# Altium project OZ440-SE100-CAR003.PrjPcb (part 3 of 3)

## Sheet OZ440-SE100-CAR003_sheet13.SchDoc
size A3
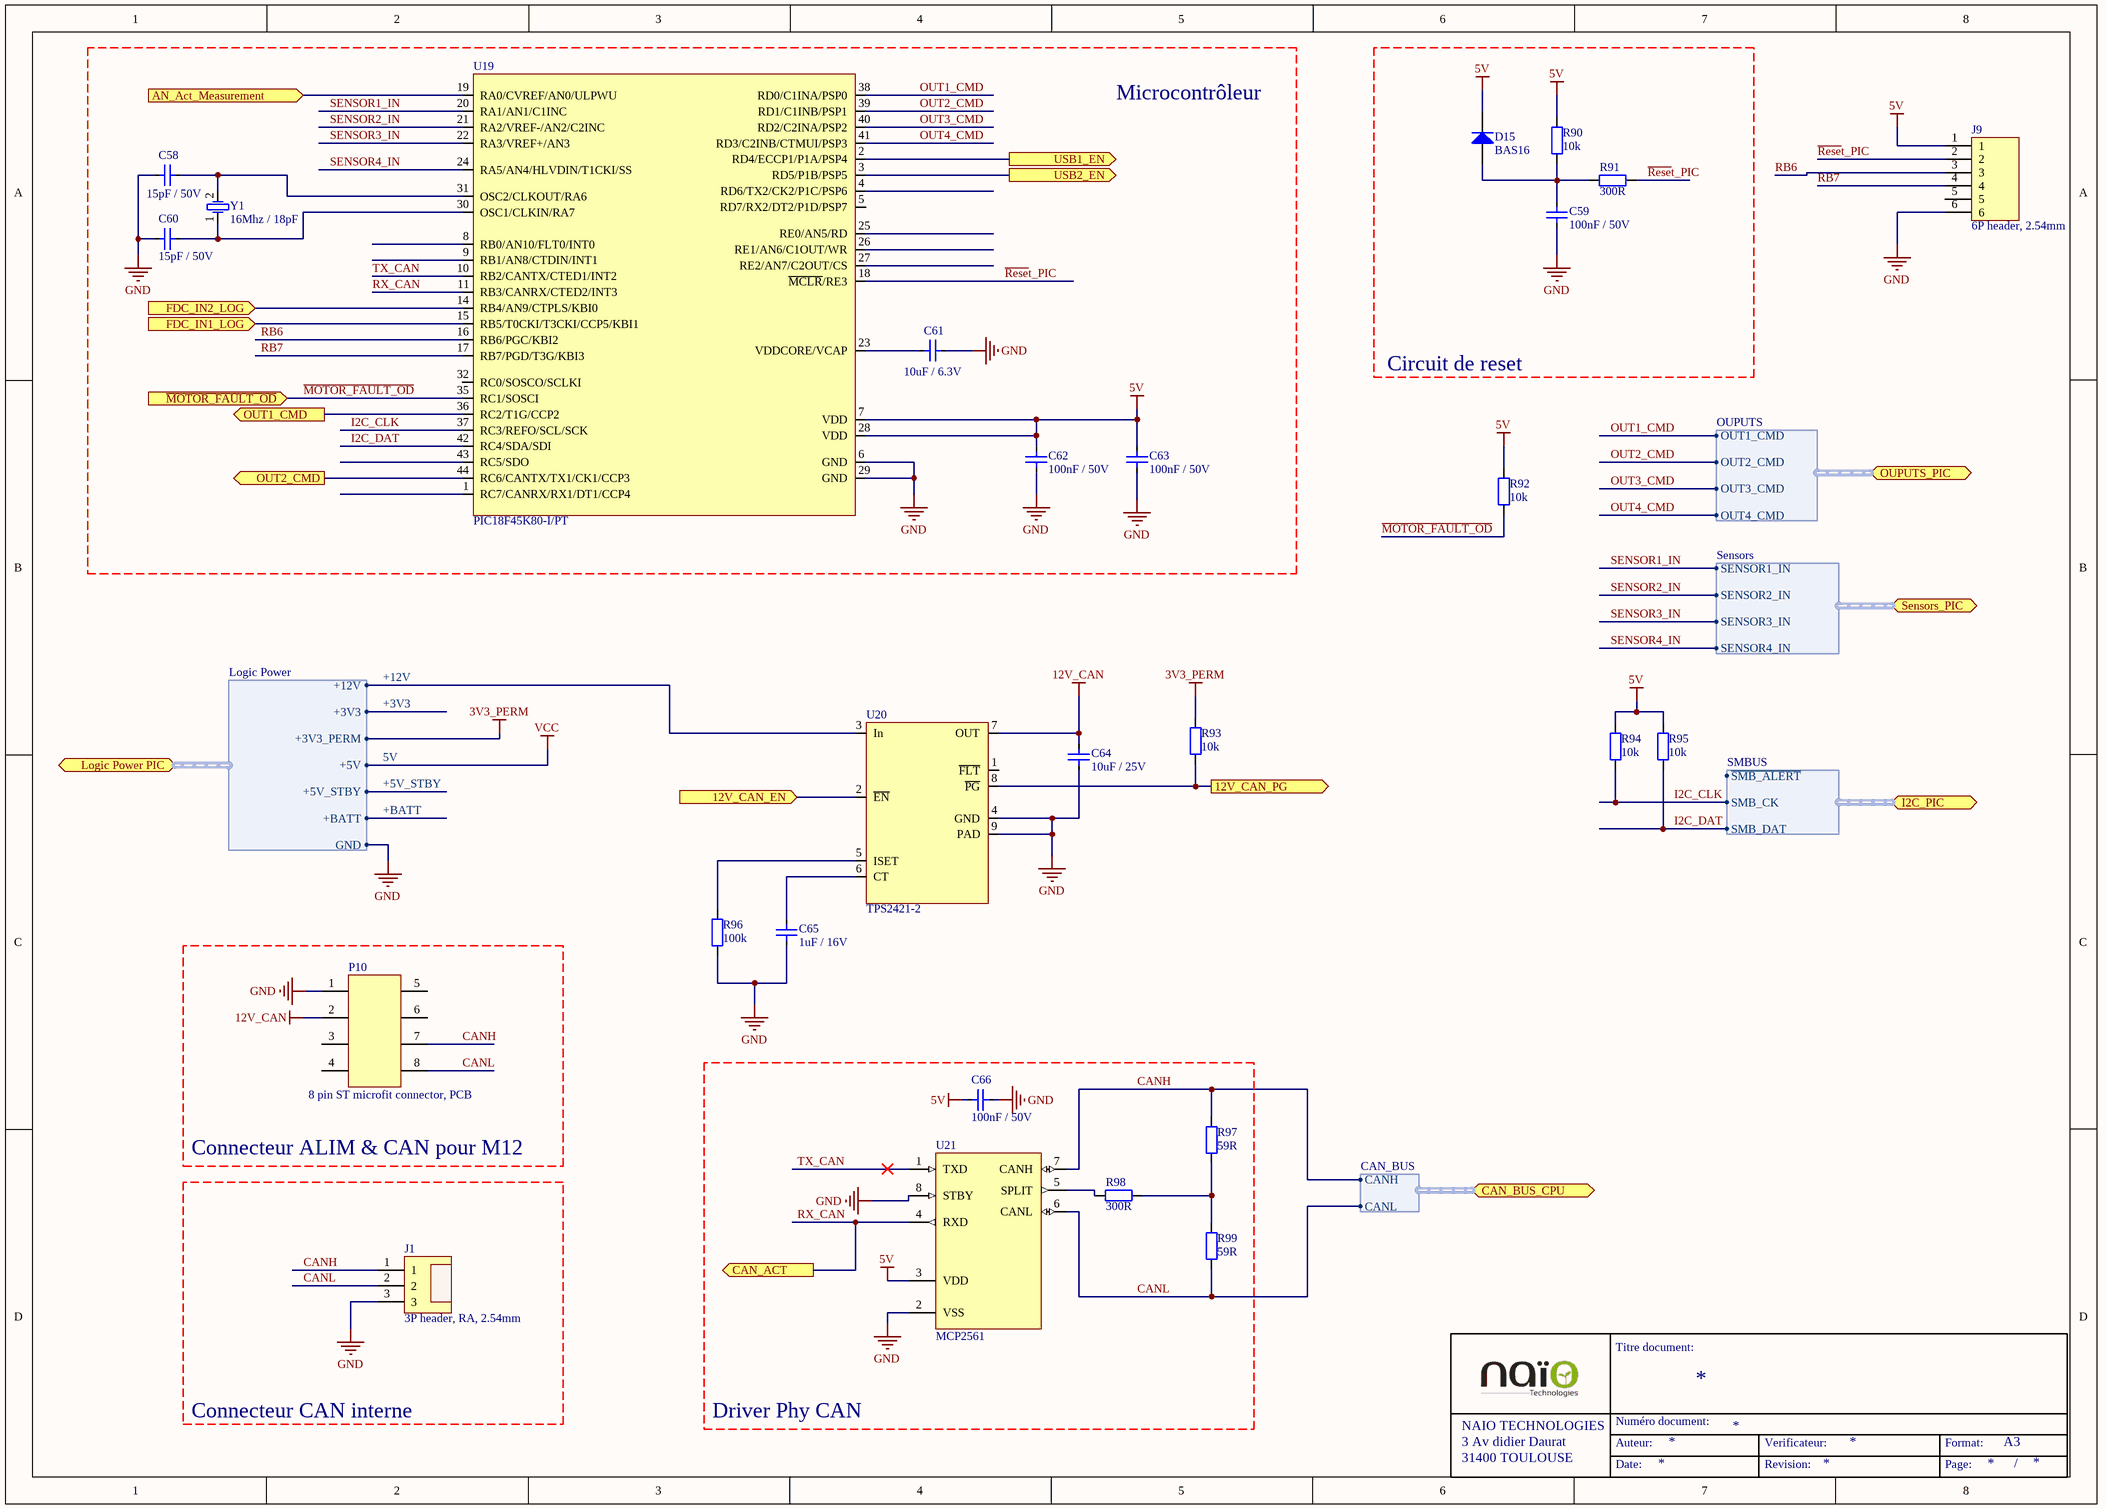
[diagram p12: OZ440-SE100-CAR003_sheet13.SchDoc]

### Parts
C58  Displayed reference: 15pF / 50V  [C0805-STD]  (hidden comment: CAP-SMD)
C59  Displayed reference: 100nF / 50V  [C0805-STD]  (hidden comment: CAP-SMD)
C60  Displayed reference: 15pF / 50V  [C0805-STD]  (hidden comment: CAP-SMD)
C61  Displayed reference: 10uF / 6.3V  [C0805-STD]  (hidden comment: CAP-SMD)
C62  Displayed reference: 100nF / 50V  [C0805-STD]  (hidden comment: CAP-SMD)
C63  Displayed reference: 100nF / 50V  [C0805-STD]  (hidden comment: CAP-SMD)
C64  Displayed reference: 10uF / 25V  [C1206-STD]  (hidden comment: CAP-SMD)
C65  Displayed reference: 1uF / 16V  [C0805-STD]  (hidden comment: CAP-SMD)
C66  Displayed reference: 100nF / 50V  [C0805-STD]  (hidden comment: CAP-SMD)
D15  Displayed reference: BAS16  [SOT23-STD]  (hidden comment: BAS16-SOT23)
J1  Displayed reference: 3P header, RA, 2.54mm  [CONN-SPE_MOLEX_0015913033]  (hidden comment: CONN-STD-3P_1ROW)
J9  Displayed reference: 6P header, 2.54mm  [6P_HEADER-STD_TH_1ROW]  (hidden comment: CONN-STD-6P_1ROW)
P10  Displayed reference: 8 pin ST microfit connector, PCB  [CONN-SPE_MOLEX_43045-0812]  (hidden comment: CONN-SPE-8P_MOLEX_43045-0801)
R90  Displayed reference: 10k  [R0805-STD]  (hidden comment: RES-SMD)
R91  Displayed reference: 300R  [R0805-STD]  (hidden comment: RES-SMD)
R92  Displayed reference: 10k  [R0805-STD]  (hidden comment: RES-SMD)
R93  Displayed reference: 10k  [R0805-STD]  (hidden comment: RES-SMD)
R94  Displayed reference: 10k  [R0805-STD]  (hidden comment: RES-SMD)
R95  Displayed reference: 10k  [R0805-STD]  (hidden comment: RES-SMD)
R96  Displayed reference: 100k  [R0805-STD]  (hidden comment: RES-SMD)
R97  Displayed reference: 59R  [R0805-STD]  (hidden comment: RES-SMD)
R98  Displayed reference: 300R  [R0805-STD]  (hidden comment: RES-SMD)
R99  Displayed reference: 59R  [R0805-STD]  (hidden comment: RES-SMD)
U19  Displayed reference: PIC18F45K80-I/PT  [TQFP44-SPE-PIC18F45k80]  (hidden comment: P18F45K80-TQFP44)
U20  Displayed reference: TPS2421-2  [SO8_THERMAL-STD]  (hidden comment: TPS2421-SO8)
U21  Displayed reference: MCP2561  [SO8-SPE-MCP2561]  (hidden comment: MCP2561-SOIC08)
Y1  Displayed reference: 16Mhz / 18pF  [XTAL-SPE-HC49_SMD]  (hidden comment: XTAL-SMD)

### Ports
12V_CAN_EN (in), 12V_CAN_PG (out), AN_Act_Measurement (in), CAN_ACT (out), CAN_BUS_CPU (harness CAN_BUS), FDC_IN1_LOG (in), FDC_IN2_LOG (in), I2C_PIC (harness SMBUS), Logic Power PIC (harness Logic Power), OUPUTS_PIC (harness OUPUTS), OUT1_CMD (out), OUT2_CMD (out), Sensors_PIC (harness Sensors), USB1_EN (out), USB2_EN (out), ~{MOTOR_FAULT_OD} (in)

### Harnesses
CAN_BUS: CANH, CANL
Logic Power: +12V, +3V3, +3V3_PERM, +5V, +5V_STBY, +BATT, GND
OUPUTS: OUT1_CMD, OUT2_CMD, OUT3_CMD, OUT4_CMD
Sensors: SENSOR1_IN, SENSOR2_IN, SENSOR3_IN, SENSOR4_IN
SMBUS: ~{SMB_ALERT}, SMB_CK, SMB_DAT

### Nets
3V3_PERM: R93.1 ; port Logic Power PIC.+3V3_PERM  [project net +3V3_PERM]
12V_CAN: C64.2 P10.2 U20.7(OUT)
+5V_STBY: C62.2 C63.2 C66.2 D15.3(K) J9.1 R90.2 R92.2 R94.2 R95.2 U19.7(VDD) U19.28(VDD) U21.3(VDD) ; port Logic Power PIC.+5V, port Logic Power PIC.+5V_STBY  [also labelled 5V, VCC]  [project net +5V]
GND: C58.1 C59.1 C60.1 C61.2 C62.1 C63.1 C64.1 C65.1 C66.1 J1.3 J9.6 P10.1 R96.1 U19.6(GND) U19.29(GND) U20.4(GND) U20.9(PAD) U21.2(VSS) U21.8(STBY) ; port Logic Power PIC.GND  [project net Logic_Power.GND]
12V_CAN_EN: U20.2(~{EN}) ; port 12V_CAN_EN
12V_CAN_PG: R93.2 U20.8(~{PG}) ; port 12V_CAN_PG
+12V: U20.3(In) ; port Logic Power PIC.+12V
~{MOTOR_FAULT_OD}: R92.1 U19.35(RC1/SOSCI) ; port ~{MOTOR_FAULT_OD}
~{Rese}t_PIC: J9.2 R91.2 U19.18(~{MCLR}/RE3)
CANH: J1.1 P10.7 R97.2 U21.7(CANH) ; port CAN_BUS_CPU.CANH  [project net CAN_bus.CANH]
CANL: J1.2 P10.8 R99.1 U21.6(CANL) ; port CAN_BUS_CPU.CANL  [project net CAN_bus.CANL]
I2C_CLK: R94.1 U19.37(RC3/REFO/SCL/SCK) ; port I2C_PIC.SMB_CK
I2C_DAT: R95.1 U19.42(RC4/SDA/SDI) ; port I2C_PIC.SMB_DAT
OUT1_CMD: U19.38(RD0/C1INA/PSP0) ; port OUPUTS_PIC.OUT1_CMD
OUT2_CMD: U19.39(RD1/C1INB/PSP1) ; port OUPUTS_PIC.OUT2_CMD
OUT3_CMD: U19.40(RD2/C2INA/PSP2) ; port OUPUTS_PIC.OUT3_CMD
OUT4_CMD: U19.41(RD3/C2INB/CTMUI/PSP3) ; port OUPUTS_PIC.OUT4_CMD
RB6: J9.3 U19.16(RB6/PGC/KBI2)
RB7: J9.4 U19.17(RB7/PGD/T3G/KBI3)
RX_CAN: U19.11(RB3/CANRX/CTED2/INT3) U21.4(RXD) ; port CAN_ACT  [project net CAN_ACT]
SENSOR1_IN: U19.20(RA1/AN1/C1INC) ; port Sensors_PIC.SENSOR1_IN
SENSOR2_IN: U19.21(RA2/VREF-/AN2/C2INC) ; port Sensors_PIC.SENSOR2_IN
SENSOR3_IN: U19.22(RA3/VREF+/AN3) ; port Sensors_PIC.SENSOR3_IN
SENSOR4_IN: U19.24(RA5/AN4/HLVDIN/T1CKI/SS) ; port Sensors_PIC.SENSOR4_IN
TX_CAN: U19.10(RB2/CANTX/CTED1/INT2) U21.1(TXD)
NetC51_2: U19.19(RA0/CVREF/AN0/ULPWU) ; port AN_Act_Measurement
NetC52_2: U19.15(RB5/T0CKI/T3CKI/CCP5/KBI1) ; port FDC_IN1_LOG
NetC53_2: U19.14(RB4/AN9/CTPLS/KBI0) ; port FDC_IN2_LOG
NetC58_2: C58.2 U19.31(OSC2/CLKOUT/RA6) Y1.2(OSC2)
NetC59_2: C59.2 D15.1(A) R90.1 R91.1
NetC60_2: C60.2 U19.30(OSC1/CLKIN/RA7) Y1.1(OSC1)
NetC61_1: C61.1 U19.23(VDDCORE/VCAP)
NetC65_2: C65.2 U20.6(CT)
NetQ28_1: U19.2(RD4/ECCP1/P1A/PSP4) ; port USB1_EN
NetQ29_1: U19.3(RD5/P1B/PSP5) ; port USB2_EN
NetR83_1: U19.36(RC2/T1G/CCP2) ; port OUT1_CMD
NetR84_1: U19.44(RC6/CANTX/TX1/CK1/CCP3) ; port OUT2_CMD
NetR96_2: R96.2 U20.5(ISET)
NetR97_1: R97.1 R98.2 R99.2
NetR98_1: R98.1 U21.5(SPLIT)

Not connected (* = marked no-connect by the designer): J9 5; P10 3 4(7) 5(9) 6; U19 1(RC7/CANRX/RX1/DT1/CCP4) 4(RD6/TX2/CK2/P1C/PSP6) 5(RD7/RX2/DT2/P1D/PSP7) 8(RB0/AN10/FLT0/INT0) 9(RB1/AN8/CTDIN/INT1) 25(RE0/AN5/RD) 26(RE1/AN6/C1OUT/WR) 27(RE2/AN7/C2OUT/CS) 32(RC0/SOSCO/SCLKI) 43(RC5/SDO); U20 1(~{FLT})

### Notes on the sheet
- Microcontrôleur
- Circuit de reset
- Connecteur ALIM & CAN pour M12
- Connecteur CAN interne
- Driver Phy CAN
- Titre document:
- NAIO TECHNOLOGIES
- 3 Av didier Daurat
- 31400 TOULOUSE
- Auteur:
- Numéro document:
- Verificateur:
- Format:
- A3
- Date:
- Revision:
- Page:
- /

### Library data of the parts
C58 C60 = C0805C150J5GACxx: 0805 15pF / 50V COG ceramic capacitor; Manufacturer: Kemet; Max Voltage: 50; Tolerance: +/- 5%; Validated: N; Reference: C0805C150J5GACxx; Value: 15pF; Material: COG; Footprint description: standard Capacitor 0805; Pin Count: 2; helpURL: http://www.farnell.com/datasheets/40863.pdf; Supplier 1: Farnell; Supplier Part Number 1: 1650868; Supplier 2: Digi-Key; Supplier Part Number 2: 399-1111-1-ND
C59 C62 C63 C66 = VJ0805Y104KXAxx: 0805 100nF / 50V  X7R ceramic capacitor; Manufacturer: vishay; Max Voltage: 50; Tolerance: +/- 10%; Validated: N; Reference: VJ0805Y104KXAxx; Value: 100nF; Material: X7R; Footprint description: standard Capacitor 0805; Pin Count: 2; helpURL: http://www.vishay.com/docs/45200/highrels.pdf; Supplier 1: Farnell; Supplier Part Number 1: 1612208; Supplier 2: Digi-Key; Supplier Part Number 2: 720-1266-6-ND
C61 = C0805C106K9PACxx: 0805 10uF / 6.3V X5R ceramic capacitor; Manufacturer: Kemet; Max Voltage: 6.3; Tolerance: +/- 10%; Validated: N; Reference: C0805C106K9PACxx; Value: 10uF; Material: X5R; Footprint description: standard Capacitor 0805; Pin Count: 2; helpURL: http://www.farnell.com/datasheets/40863.pdf; Supplier 1: Farnell; Supplier Part Number 1: 1643357; Supplier 2: Digi-Key; Supplier Part Number 2: 399-3138-1-ND
C64 = C1206C106K3RACxx: 1206 10uF / 25V X7R ceramic capacitor; Manufacturer: Kemet; Max Voltage: 25; Tolerance: +/- 10%; Validated: N; Reference: C1206C106K3RACxx; Value: 10uF; Material: X7R; Footprint description: standard Capacitor 1206; Pin Count: 2; helpURL: http://www.farnell.com/datasheets/1444528.pdf; Supplier 1: Farnell; Supplier Part Number 1: 2118134; Supplier 2: Digi-Key; Supplier Part Number 2: 399-7442-1-ND
C65 = C0805C105K4RACxx: 0805 1uF / 16V X7R ceramic capacitor; Manufacturer: Kemet; Max Voltage: 16; Tolerance: +/- 10%; Validated: N; Reference: C0805C105K4RACxx; Value: 1uF; Material: X7R; Footprint description: standard Capacitor 0805; Pin Count: 2; helpURL: http://www.farnell.com/datasheets/40863.pdf; Supplier 1: Farnell; Supplier Part Number 1: 9227792; Supplier 2: Digi-Key; Supplier Part Number 2: 399-6930-1-ND
D15 = BAS16: 100V / 120mA signal  diode; Manufacturer: NXP; Max Voltage: 100; Max Current: 0.2A; Validated: False; Reference: BAS16; component type: DIODE; Footprint description: Sot23 SMD package; Pin Count: 3; Rev: 2010; helpURL: http://www.nxp.com/documents/data_sheet/BAS16_SER.pdf; Supplier 1: Farnell; Supplier Part Number 1: 1081180; Supplier 2: Digi-Key; Supplier Part Number 2: 568-1596-1-ND
J1 = 0015913033: 3 pin , 2.54mm SMD header; Manufacturer: Molex; Validated: False; Reference: 0015913033; Footprint description: 3P header, RA, 2.54mm; Pin Count: 3; Rev: G; helpURL: http://www.molex.com/pdm_docs/sd/015913033_sd.pdf; Supplier 1: Mouser; Supplier Part Number 1: 538-15-91-3033; Supplier 2: Digi-Key; Supplier Part Number 2: 0015913033-ND
J9 = 68000-406HLF: 6P, 1 row, 2.54mm header; Manufacturer: FCI; Validated: False; Reference: 68000-406HLF; Footprint description: TH, 6 pin, 2.54mm; Pin Count: 6; Rev: DB; helpURL: http://portal.fciconnect.com/Comergent//fci/drawing/68000.pdf
P10 = 43045-0812: 8 pin Microfit connector; Manufacturer: Molex; Max Voltage: 600V; Max Current: 5A; Reference: 43045-0812; Footprint description: 8 pin SMT connector ST, TH; Rev: G; helpURL: http://www.molex.com/pdm_docs/sd/430450812_sd.pdf
R90 R92-R95 = CRCW080510K0FKxx: 10k Ohm 0805 SMD resistor; Manufacturer: Vishay; Value: 10 000; Tolerance: 1 %; Rated Power: 0,125 W; Validated: No; Reference: CRCW080510K0FKxx; Footprint description: standard 0805 SMD; Pin Count: 2; helpURL: http://www.vishay.com/docs/20035/dcrcwe3.pdf; Supplier 1: Farnell; Supplier Part Number 1: 1469856; Supplier 2: Mouser; Supplier Part Number 2: 71-CRCW0805-10K-E3
R91 R98 = CRCW0805300RFKxx: 300 ohm 0805 SMD resistor; Manufacturer: Vishay; Value: 300; Tolerance: 1%; Rated Power: 0.125W; Validated: No; Reference: CRCW0805300RFKxx; Footprint description: standard 0805 SMD; Pin Count: 2; helpURL: http://www.vishay.com/docs/20035/dcrcwe3.pdf; Supplier 1: Mouser; Supplier Part Number 1: 71-CRCW0805300RFKEA; Supplier 2: Farnell; Supplier Part Number 2: 1152346
R96 = CRCW0805100KFKxx: 100k Ohm 0805 SMD resistor; Manufacturer: Vishay; Value: 100 000; Tolerance: 1 %; Rated Power: 0,125 W; Validated: No; Reference: CRCW0805100KFKxx; Footprint description: standard 0805 SMD; Pin Count: 2; helpURL: http://www.vishay.com/docs/20035/dcrcwe3.pdf; Supplier 1: Farnell; Supplier Part Number 1: 1469860; Supplier 2: Mouser; Supplier Part Number 2: 71-CRCW0805-100K-E3
R97 R99 = CRCW080559R0FKxx: 59 Ohm 0805 SMD resistor; Manufacturer: Vishay; Value: 59; Tolerance: 1 %; Rated Power: 0.125 W; Validated: No; Reference: CRCW080559R0FKxx; Footprint description: standard 0805 SMD; Pin Count: 2; helpURL: http://www.vishay.com/docs/20035/dcrcwe3.pdf; Supplier 1: Mouser; Supplier Part Number 1: 71-CRCW080559R0FKEA; Supplier 2: Farnell; Supplier Part Number 2: 2138817
U19 = PIC18F45K80-I/PT: Pic microcontroller with embeded CAN controller; Manufacturer: MICROCHIP; Validated: False; Reference: PIC18F45K80-I/PT; Footprint description: standard TQFP 44 pin; Pin Count: 44; Rev: F; helpURL: http://ww1.microchip.com/downloads/en/DeviceDoc/39977f.pdf; Supplier 1: Farnell; Supplier Part Number 1: 1823169; Supplier 2: Mouser; Supplier Part Number 2: 579-PIC18F45K80-I/PT
U20 = TPS2421-2DDA: 20V-5A Hot plug controller with integrated FET, auto retry; Manufacturer: TI; Max Voltage: 20V; Max Current: 5A; Validated: False; Reference: TPS2421-2DDA; Footprint description: SO8 with thermal PAD; Pin Count: 8; Rev: 01/14; helpURL: http://www.ti.com/lit/ds/symlink/tps2421-1.pdf; Supplier 1: Mouser; Supplier Part Number 1: 595-TPS2421-2DDA; Supplier 2: Farnell; Supplier Part Number 2: 2323674
U21 = MCP2561-E/SN: CAN transceiver with common mode stabilisation; Manufacturer: Microchip; Max Voltage: 5.5V; Validated: False; Reference: MCP2561-E/SN; Footprint description: standard SO8; Pin Count: 8; Rev: B; helpURL: http://ww1.microchip.com/downloads/en/DeviceDoc/25167B.pdf; Supplier 1: Farnell; Supplier Part Number 1: 2362837; Supplier 2: Mouser; Supplier Part Number 2: 579-MCP2561-E/SN
Y1 = ABLS2-16.000MHZ-D4Y-T: 16Mhz Crystal / low profile 3.3mm; Manufacturer: Abracon; Value: 16 000; Validated: False; Reference: ABLS2-16.000MHZ-D4Y-T; Footprint description: HC49 Low_profile; Pin Count: 2; Frequency band: 16Mhz; helpURL: http://www.farnell.com/datasheets/1749648.pdf; Supplier 1: Farnell; Supplier Part Number 1: 1885210; Supplier 2: Mouser; Supplier Part Number 2: 815-ABLS2-16-D4Y-T

## Sheet OZ440-SE100-CAR003_sheet14.SchDoc
size A3
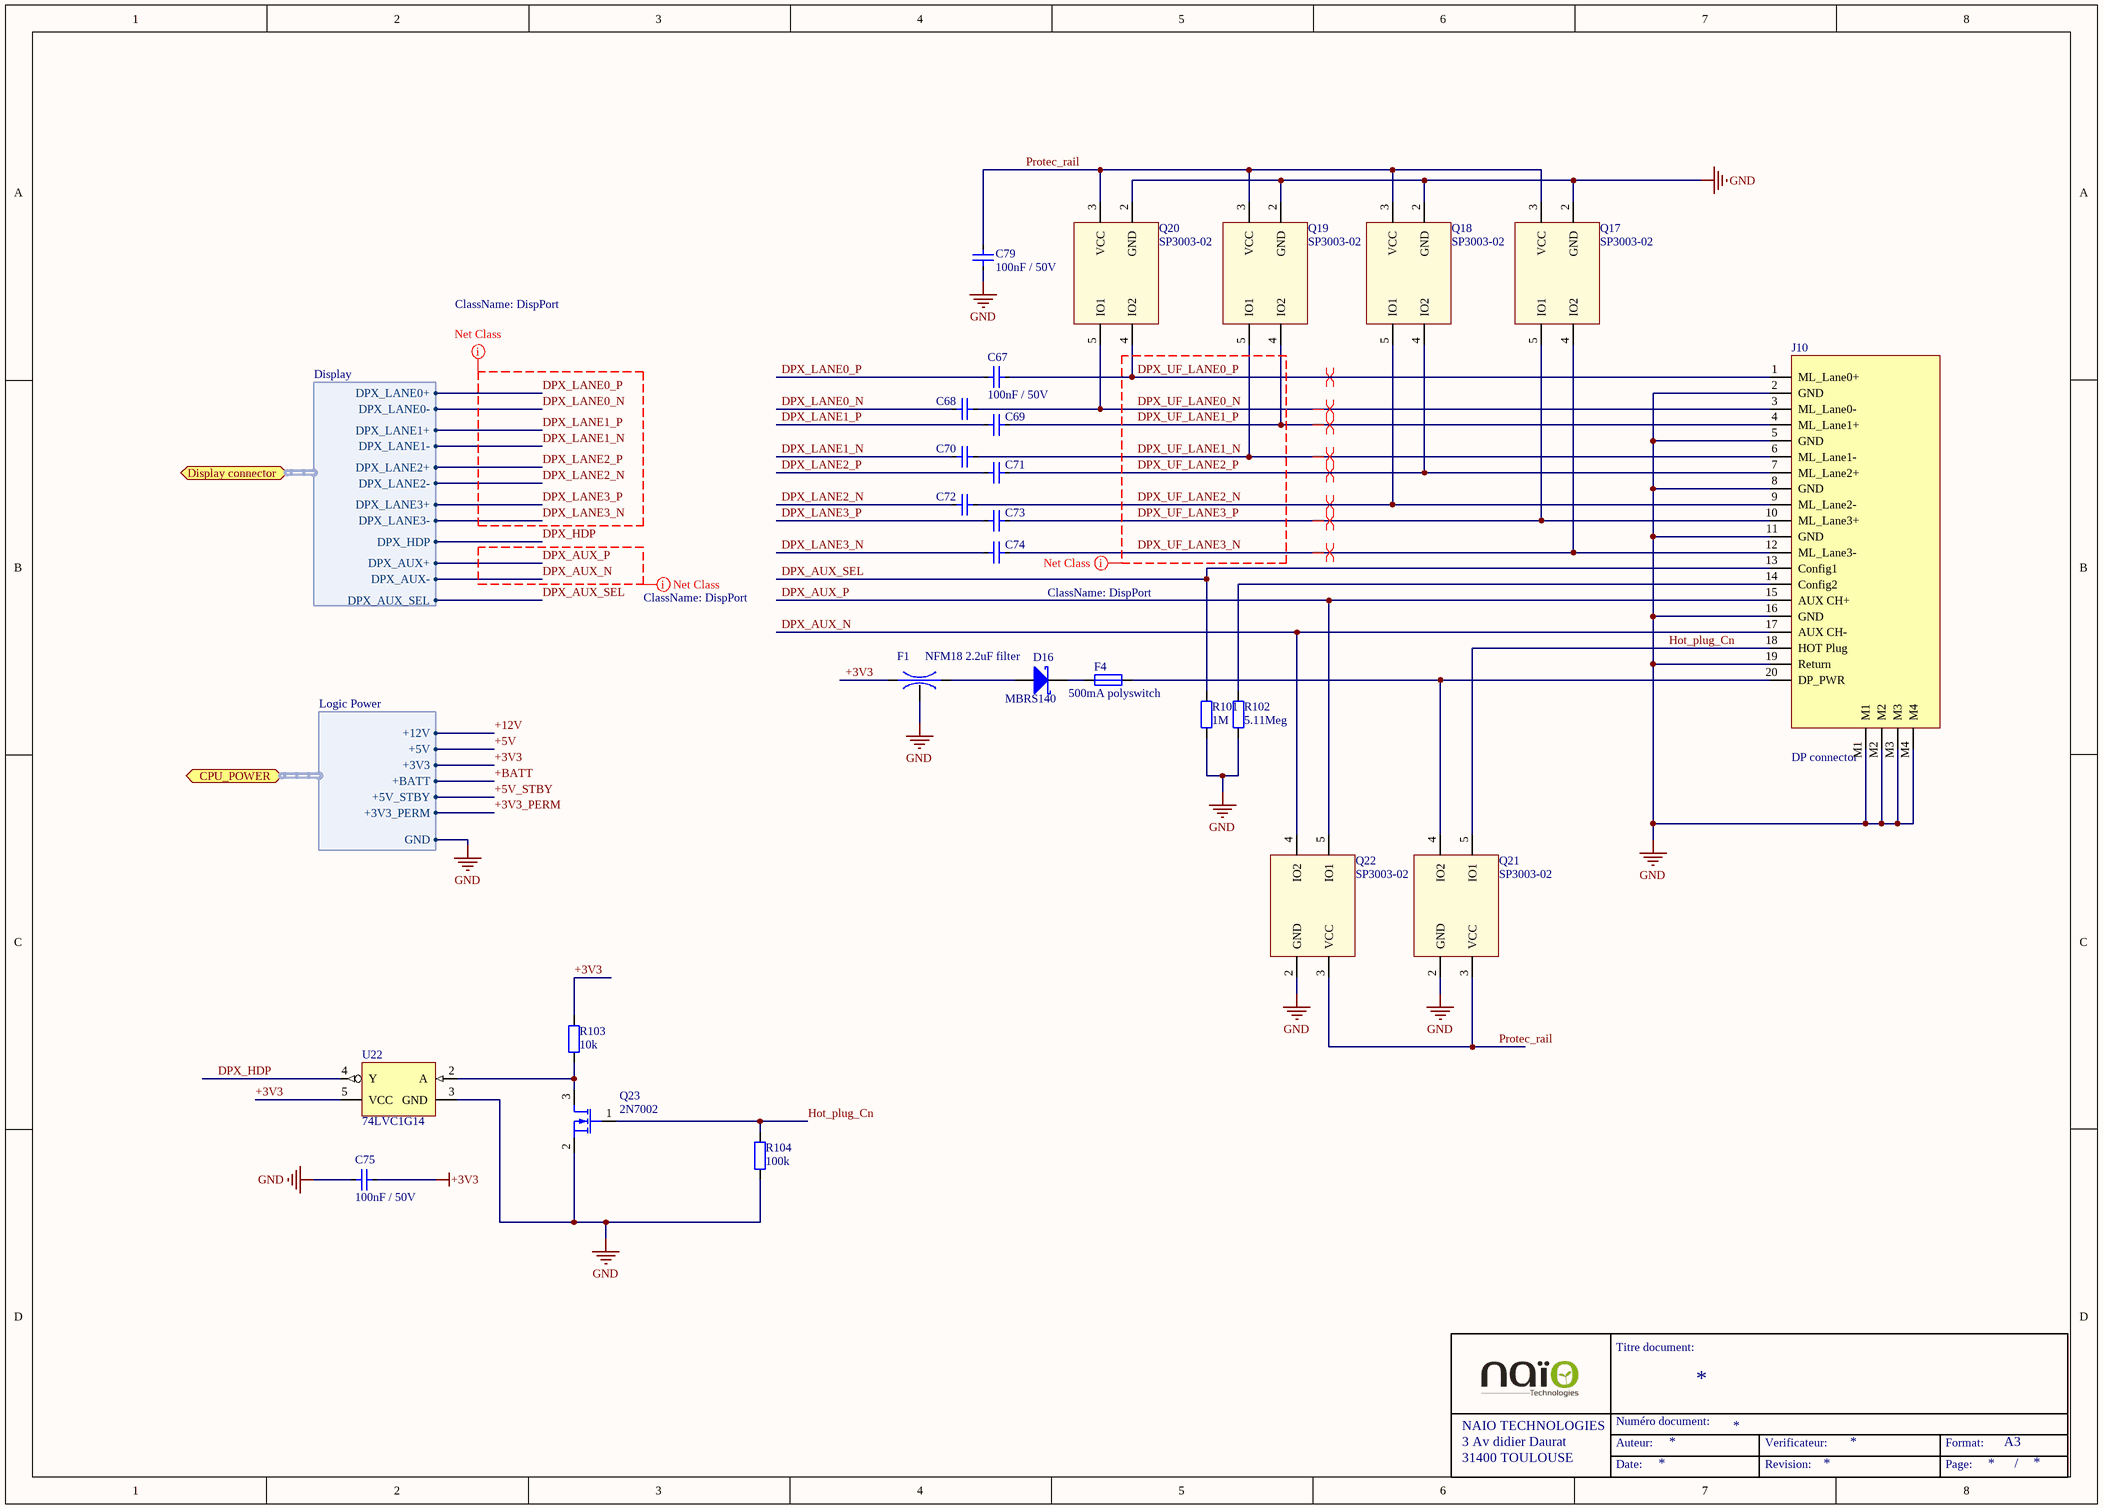
[diagram p13: OZ440-SE100-CAR003_sheet14.SchDoc]

### Parts
C67  Displayed reference: 100nF / 50V  [C0805-STD]  (hidden comment: CAP-SMD)
C68  CAP-SMD  [C0805-STD]  (value not drawn)
C69  CAP-SMD  [C0805-STD]  (value not drawn)
C70  CAP-SMD  [C0805-STD]  (value not drawn)
C71  CAP-SMD  [C0805-STD]  (value not drawn)
C72  CAP-SMD  [C0805-STD]  (value not drawn)
C73  CAP-SMD  [C0805-STD]  (value not drawn)
C74  CAP-SMD  [C0805-STD]  (value not drawn)
C75  Displayed reference: 100nF / 50V  [C0805-STD]  (hidden comment: CAP-SMD)
C79  Displayed reference: 100nF / 50V  [C0805-STD]  (hidden comment: CAP-SMD)
D16  Displayed reference: MBRS140  [DO214AA-STD]  (hidden comment: DIODE_SCHOTKY-DO214AA)
F1  Displayed reference: NFM18 2.2uF filter  [LC_0603-STD]  (hidden comment: LC_FILTER-STD)
F4  Displayed reference: 500mA polyswitch  [R0805-STD]  (hidden comment: FUSE-SMD)
J10  Displayed reference: DP connector  [CONN-SPE-DISPLAY_PORT_DP1RD20JQ1R400_JAE]  (hidden comment: CONN-STD-DISPLAY_PORT_B)
Q17  Displayed reference: SP3003-02  [SC70-SPE-SP3003]  (hidden comment: SP03003_02-SC70)
Q18  Displayed reference: SP3003-02  [SC70-SPE-SP3003]  (hidden comment: SP03003_02-SC70)
Q19  Displayed reference: SP3003-02  [SC70-SPE-SP3003]  (hidden comment: SP03003_02-SC70)
Q20  Displayed reference: SP3003-02  [SC70-SPE-SP3003]  (hidden comment: SP03003_02-SC70)
Q21  Displayed reference: SP3003-02  [SC70-SPE-SP3003]  (hidden comment: SP03003_02-SC70)
Q22  Displayed reference: SP3003-02  [SC70-SPE-SP3003]  (hidden comment: SP03003_02-SC70)
Q23  Displayed reference: 2N7002  [SOT23-SPE-2N7002]  (hidden comment: 2N7002-SMD3P)
R101  Displayed reference: 1M  [R0805-STD]  (hidden comment: RES-SMD)
R102  Displayed reference: 5.11Meg  [R0805-STD]  (hidden comment: RES-SMD)
R103  Displayed reference: 10k  [R0805-STD]  (hidden comment: RES-SMD)
R104  Displayed reference: 100k  [R0805-STD]  (hidden comment: RES-SMD)
U22  Displayed reference: 74LVC1G14  [SOT353-1_5pin-STD]  (hidden comment: 74xxx1G14GW-SOT353-1)

### Ports
CPU_POWER (harness Logic Power), Display connector (harness Display)

### Harnesses
Display: DPX_LANE0+, DPX_LANE0-, DPX_LANE1+, DPX_LANE1-, DPX_LANE2+, DPX_LANE2-, DPX_LANE3+, DPX_LANE3-, DPX_HDP, DPX_AUX+, DPX_AUX-, DPX_AUX_SEL
Logic Power: +12V, +5V, +3V3, +BATT, +5V_STBY, GND, +3V3_PERM

### Nets
+3V3: C75.2 F1.1(A) R103.2 U22.5(VCC) ; port CPU_POWER.+3V3
+5V: port CPU_POWER.+5V, port CPU_POWER.+5V_STBY  [also labelled +5V_STBY]
GND: C75.1 C79.1 F1.3(G) J10.2(GND) J10.5(GND) J10.8(GND) J10.11(GND) J10.16(GND) J10.19(Return) J10.M1 J10.M2 J10.M3 J10.M4 Q17.2(GND) Q18.2(GND) Q19.2(GND) Q20.2(GND) Q21.2(GND) Q22.2(GND) Q23.2(S) R101.1 R102.1 R104.1 U22.3(GND) ; port CPU_POWER.GND  [project net Logic_Power.GND]
DPX_AUX_N: J10.17(AUX_CH-) Q22.4(IO2) ; port Display connector.DPX_AUX-
DPX_AUX_P: J10.15(AUX_CH+) Q22.5(IO1) ; port Display connector.DPX_AUX+
DPX_AUX_SEL: J10.13(Config1) R101.2 ; port Display connector.DPX_AUX_SEL
DPX_HDP: U22.4(Y) ; port Display connector.DPX_HDP
DPX_LANE0_N: C68.2 ; port Display connector.DPX_LANE0-
DPX_LANE0_P: C67.2 ; port Display connector.DPX_LANE0+
DPX_LANE1_N: C70.2 ; port Display connector.DPX_LANE1-
DPX_LANE1_P: C69.2 ; port Display connector.DPX_LANE1+
DPX_LANE2_N: C72.2 ; port Display connector.DPX_LANE2-
DPX_LANE2_P: C71.2 ; port Display connector.DPX_LANE2+
DPX_LANE3_N: C74.2 ; port Display connector.DPX_LANE3-
DPX_LANE3_P: C73.2 ; port Display connector.DPX_LANE3+
DPX_UF_LANE0_N: C68.1 J10.3(ML_Lane0-) Q20.5(IO1)
DPX_UF_LANE0_P: C67.1 J10.1(ML_Lane0+) Q20.4(IO2)
DPX_UF_LANE1_N: C70.1 J10.6(ML_Lane1-) Q19.5(IO1)
DPX_UF_LANE1_P: C69.1 J10.4(ML_Lane1+) Q19.4(IO2)
DPX_UF_LANE2_N: C72.1 J10.9(ML_Lane2-) Q18.5(IO1)
DPX_UF_LANE2_P: C71.1 J10.7(ML_Lane2+) Q18.4(IO2)
DPX_UF_LANE3_N: C74.1 J10.12(ML_Lane3-) Q17.4(IO2)
DPX_UF_LANE3_P: C73.1 J10.10(ML_Lane3+) Q17.5(IO1)
Hot_plug_Cn: J10.18(HOT_Plug) Q21.5(IO1) Q23.1(G) R104.2
Protec_rail: C79.2 Q17.3(VCC) Q18.3(VCC) Q19.3(VCC) Q20.3(VCC) Q21.3(VCC) Q22.3(VCC)
NetD16_A: D16.A F1.2(B)
NetD16_K: D16.K F4.1
NetF4_2: F4.2 J10.20(DP_PWR) Q21.4(IO2)
NetJ10_14: J10.14(Config2) R102.2
NetQ23_3: Q23.3(D) R103.1 U22.2(A)

### Layout directives
net class DispPort: DPX_AUX_N, DPX_AUX_P, DPX_LANE0_N, DPX_LANE0_P, DPX_LANE1_N, DPX_LANE1_P, DPX_LANE2_N, DPX_LANE2_P, DPX_LANE3_N, DPX_LANE3_P, DPX_UF_LANE0_N, DPX_UF_LANE0_P, DPX_UF_LANE1_N, DPX_UF_LANE1_P, DPX_UF_LANE2_N, DPX_UF_LANE2_P, DPX_UF_LANE3_N, DPX_UF_LANE3_P
differential pair: DPX_UF_LANE0_N, DPX_UF_LANE0_P, DPX_UF_LANE1_N, DPX_UF_LANE1_P, DPX_UF_LANE2_N, DPX_UF_LANE2_P, DPX_UF_LANE3_N, DPX_UF_LANE3_P

### Notes on the sheet
- Titre document:
- NAIO TECHNOLOGIES
- 3 Av didier Daurat
- 31400 TOULOUSE
- Auteur:
- Numéro document:
- Verificateur:
- Format:
- A3
- Date:
- Revision:
- Page:
- /

### Library data of the parts
C67-C75 C79 = VJ0805Y104KXAxx: as C59 on sheet OZ440-SE100-CAR003_sheet13; Reference: VJ0805Y104KXAxx; Value: 100nF; Material: X7R; Footprint description: standard Capacitor 0805; Pin Count: 2; helpURL: http://www.vishay.com/docs/45200/highrels.pdf; Supplier 1: Farnell; Supplier Part Number 1: 1612208; Supplier 2: Digi-Key; Supplier Part Number 2: 720-1266-6-ND
  C68-C74: Displayed reference: 100nF / 50V
D16 = MBRS140: 1A/40V shottky diode in SMB package; Manufacturer: FAIRCHILD; Max Voltage: 40V; Max Current: 1A; Rated Power: 0.6W; Validated: False; Reference: MBRS140; component type: DIODE; Footprint description: DO-214AA SMD footprint; Pin Count: 2; Rev: B2; helpURL: http://www.fairchildsemi.com/ds/MB/MBRS140.pdf; Supplier 1: Farnell; Supplier Part Number 1: 1467526; Supplier 2: Digi-Key; Supplier Part Number 2: MBRS140FSCT-ND
F1 = NFM18PC225B0J3: 2A LC filter; Manufacturer: MURATA; Max Voltage: 6.3; Frequency band: 0-20Mhz; Validated: False; Reference: NFM18PC225B0J3; Max Current: 2A; Footprint description: standard 0603 filter package; Pin Count: 3; Rev: 2/11/2011; helpURL: http://www.murata.com/products/emc/application/pdf/EMIAPDCE_2.pdf; Supplier 1: Digi-Key; Supplier Part Number 1: NFM18PC225B0J3D-ND; Supplier 2: Mouser; Supplier Part Number 2: 81-NFM18PC225B0J3D
F4 = MF-PSMF050X-2: 0805 500mA resettable fuse; Manufacturer: BOURNS; Validated: False; Reference: MF-PSMF050X-2; Max Current: 500mA; Pin Count: 2; helpURL: http://www.farnell.com/datasheets/1442129.pdf; Supplier 1: Farnell; Supplier Part Number 1: 1294876; Supplier 2: Mouser; Supplier Part Number 2: 652-MF-PSMF050X-2
J10 = DP1RD20JQ1: Display port PCB connector; Manufacturer: JAE; Validated: False; Reference: DP1RD20JQ1; Footprint description: SMD Display port PCB connector; Pin Count: 20; Rev: 10/08; helpURL: http://jae-connector.com/en/pdf/MB-0192-1E_DP1.pdf; Supplier 1: Farnell; Supplier Part Number 1: 2057447; Supplier 2: Mouser; Supplier Part Number 2: 656-DP1RD20JQ1R400
Q17-Q22 = SP3003-02JTG: Low capacitance ESD TVS; Manufacturer: LITTLEFUSE; Max Voltage: 8V; Reference: SP3003-02JTG; component type: DIODE; Footprint description: SC70; Pin Count: 5; Rev: 20/08/13; helpURL: http://www.littelfuse.com/~/media/electronics/datasheets/tvs_diode_arrays/littelfuse_tvs_diode_array_sp3003_datasheet.pdf.pdf; Supplier 1: Farnell; Supplier Part Number 1: 2369568; Supplier 2: Mouser; Supplier Part Number 2: 576-SP3003-02JTG
Q23 = 2N7002: N-Channel Enhancement Mode Field Effect Transistor; Manufacturer: FAIRCHILD; Max Voltage: 60 V; Max Current: 0,4 A; Rated Power: 0,2 W; Validated: False; Reference: 2N7002; component type: NMOS; Footprint description: SOT23; Pin Count: 3; Rev: A1; helpURL: http://www.fairchildsemi.com/ds/2N/2N7000.pdf; Supplier 1: Farnell; Supplier Part Number 1: 9845313; Supplier 2: Newark; Supplier Part Number 2: 58K9651
R101 = CRCW08051M00FKxx: 1Mohm 1% 0805 SMD resistor; Manufacturer: Vishay; Value: 1000000; Rated Power: 0.125W; Validated: False; Reference: CRCW08051M00FKxx; Tolerance: 1%; Footprint description: standard 0805 SMD; Pin Count: 2; helpURL: http://www.vishay.com/docs/20035/dcrcwe3.pdf; Supplier 1: Farnell; Supplier Part Number 1: 2413580; Supplier 2: Mouser; Supplier Part Number 2: 71-CRCW08051M00FKEB
R102 = CRCW08055M11FKxx: 5.11Meg Ohm 0805 SMD resistor; Manufacturer: Vishay; Value: 5 110 000; Tolerance: 1%; Rated Power: 0.125W; Validated: No; Reference: CRCW08055M11FKxx; Footprint description: standard 0805 SMD; Pin Count: 2; helpURL: http://www.vishay.com/docs/20035/dcrcwe3.pdf; Supplier 1: Farnell; Supplier Part Number 1: 1152416; Supplier 2: Mouser; Supplier Part Number 2: 71-CRCW0805-5.11M-E3
R103 = CRCW080510K0FKxx: as R90 on sheet OZ440-SE100-CAR003_sheet13; Reference: CRCW080510K0FKxx; Footprint description: standard 0805 SMD; Pin Count: 2; helpURL: http://www.vishay.com/docs/20035/dcrcwe3.pdf; Supplier 1: Farnell; Supplier Part Number 1: 1469856; Supplier 2: Mouser; Supplier Part Number 2: 71-CRCW0805-10K-E3
R104 = CRCW0805100KFKxx: as R96 on sheet OZ440-SE100-CAR003_sheet13; Reference: CRCW0805100KFKxx; Footprint description: standard 0805 SMD; Pin Count: 2; helpURL: http://www.vishay.com/docs/20035/dcrcwe3.pdf; Supplier 1: Farnell; Supplier Part Number 1: 1469860; Supplier 2: Mouser; Supplier Part Number 2: 71-CRCW0805-100K-E3
U22 = 74LVC1G14GW: smith trigger inverter; Manufacturer: NXP; Max Voltage: 5,5V; Validated: False; Reference: 74LVC1G14GW; Footprint description: SOT353-1, 5 pin; Pin Count: 5; helpURL: http://www.nxp.com/documents/data_sheet/74LVC1G14.pdf; Supplier 1: Farnell; Supplier Part Number 1: 1631687; Supplier 2: Digi-Key; Supplier Part Number 2: 568-2267-1-ND

## Sheet OZ440-SE100-CAR003_sheet15.SchDoc
size A3
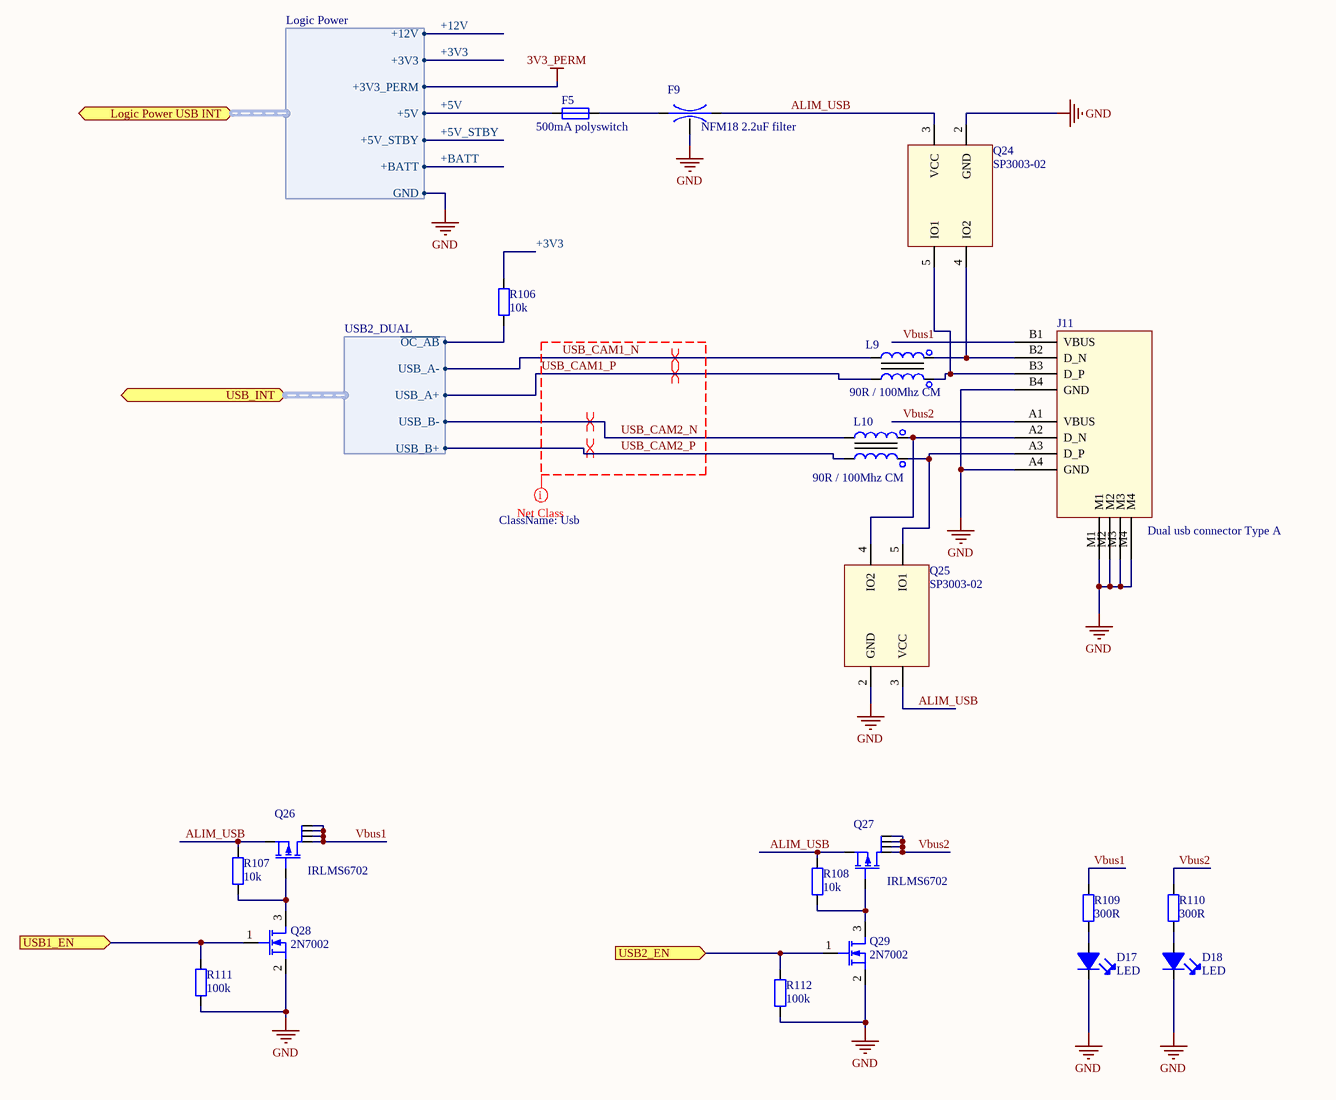
[diagram p14: OZ440-SE100-CAR003_sheet15.SchDoc]

### Parts
D17  LED  [0603-SPE-LED]
D18  LED  [0603-SPE-LED]
F5  Displayed reference: 500mA polyswitch  [R0805-STD]  (hidden comment: FUSE-SMD)
F9  Displayed reference: NFM18 2.2uF filter  [LC_0603-STD]  (hidden comment: LC_FILTER-STD)
J11  Displayed reference: Dual usb connector Type A  [CONN-STD-USB_A]  (hidden comment: CONN-STD_USB_A_DUAL)
L9  Displayed reference: 90R / 100Mhz CM  [L-SPE-0805_MC_EXC34]  (hidden comment: IND-MC-SMD)
L10  Displayed reference: 90R / 100Mhz CM  [L-SPE-0805_MC_EXC34]  (hidden comment: IND-MC-SMD)
Q24  Displayed reference: SP3003-02  [SC70-SPE-SP3003]  (hidden comment: SP03003_02-SC70)
Q25  Displayed reference: SP3003-02  [SC70-SPE-SP3003]  (hidden comment: SP03003_02-SC70)
Q26  Displayed reference: IRLMS6702  [MICRO6-SPE-IRLMS6702]  (hidden comment: IRLMS6702-MICRO6)
Q27  Displayed reference: IRLMS6702  [MICRO6-SPE-IRLMS6702]  (hidden comment: IRLMS6702-MICRO6)
Q28  Displayed reference: 2N7002  [SOT23-SPE-2N7002]  (hidden comment: 2N7002-SMD3P)
Q29  Displayed reference: 2N7002  [SOT23-SPE-2N7002]  (hidden comment: 2N7002-SMD3P)
R106  Displayed reference: 10k  [R0805-STD]  (hidden comment: RES-SMD)
R107  Displayed reference: 10k  [R0805-STD]  (hidden comment: RES-SMD)
R108  Displayed reference: 10k  [R0805-STD]  (hidden comment: RES-SMD)
R109  Displayed reference: 300R  [R0805-STD]  (hidden comment: RES-SMD)
R110  Displayed reference: 300R  [R0805-STD]  (hidden comment: RES-SMD)
R111  Displayed reference: 100k  [R0805-STD]  (hidden comment: RES-SMD)
R112  Displayed reference: 100k  [R0805-STD]  (hidden comment: RES-SMD)

### Ports
Logic Power USB INT (harness Logic Power), USB1_EN (in), USB2_EN (in), USB_INT (harness USB2_DUAL)

### Harnesses
USB2_DUAL: ~{OC_AB}, USB_A-, USB_A+, USB_B-, USB_B+
Logic Power: +12V, +3V3, +3V3_PERM, +5V, +5V_STBY, +BATT, GND

### Nets
+3V3: R106.2 ; port Logic Power USB INT.+3V3
+5V: F5.1 ; port Logic Power USB INT.+5V, port Logic Power USB INT.+5V_STBY  [also labelled +5V_STBY]
GND: D17.2 D18.2 F9.3(G) J11.A4(GND) J11.B4(GND) J11.M1 J11.M2 J11.M3 J11.M4 Q24.2(GND) Q25.2(GND) Q28.2(S) Q29.2(S) R111.1 R112.1 ; port Logic Power USB INT.GND  [project net Logic_Power.GND]
~{OC_6_7}: R106.1 ; port USB_INT.~{OC_AB}
ALIM_USB: F9.2(B) Q24.3(VCC) Q25.3(VCC) Q26.4(S) Q27.4(S) R107.2 R108.2
USB_CAM1_N: L9.2 ; port USB_INT.USB_A-  [project net USB6_N]
USB_CAM1_P: L9.3 ; port USB_INT.USB_A+  [project net USB6_P]
USB_CAM2_N: L10.2 ; port USB_INT.USB_B-  [project net USB7_N]
USB_CAM2_P: L10.3 ; port USB_INT.USB_B+  [project net USB7_P]
Vbus1: J11.B1(VBUS) Q26.1(D) Q26.2(D) Q26.5(D) Q26.6(D) R109.2
Vbus2: J11.A1(VBUS) Q27.1(D) Q27.2(D) Q27.5(D) Q27.6(D) R110.2
NetD17_1: D17.1(A) R109.1
NetD18_1: D18.1(A) R110.1
NetF5_2: F5.2 F9.1(A)
NetJ11_A2: J11.A2(D_N) L10.1 Q25.4(IO2)
NetJ11_A3: J11.A3(D_P) L10.4 Q25.5(IO1)
NetJ11_B2: J11.B2(D_N) L9.1 Q24.4(IO2)
NetJ11_B3: J11.B3(D_P) L9.4 Q24.5(IO1)
NetQ26_3: Q26.3(G) Q28.3(D) R107.1
NetQ27_3: Q27.3(G) Q29.3(D) R108.1
NetQ28_1: Q28.1(G) R111.2 ; port USB1_EN
NetQ29_1: Q29.1(G) R112.2 ; port USB2_EN

### Layout directives
differential pair: USB6_N, USB6_P, USB7_N, USB7_P
net class Usb: USB_CAM1_N, USB_CAM1_P, USB_CAM2_N, USB_CAM2_P

### Notes on the sheet
- Titre document:
- NAIO TECHNOLOGIES
- 3 Av didier Daurat
- 31400 TOULOUSE
- Auteur:
- Numéro document:
- Verificateur:
- Format:
- A3
- Date:
- Revision:
- Page:
- /

### Library data of the parts
D17 D18 = KP-1608SGC: SMD Green LED 0603; Manufacturer: KingBright; Max Current: 20mA; Reference: KP-1608SGC; Displayed reference: LED; Footprint description: 0603; Pin Count: 2; helpURL: http://www.farnell.com/datasheets/55768.pdf; Supplier 1: Farnell; Supplier Part Number 1: 8529833; Supplier 2: Newark; Supplier Part Number 2: 38K3374
F5 = MF-PSMF050X-2: as F4 on sheet OZ440-SE100-CAR003_sheet14; Reference: MF-PSMF050X-2; Max Current: 500mA; Pin Count: 2; helpURL: http://www.farnell.com/datasheets/1442129.pdf; Supplier 1: Farnell; Supplier Part Number 1: 1294876; Supplier 2: Mouser; Supplier Part Number 2: 652-MF-PSMF050X-2
F9 = NFM18PC225B0J3: as F1 on sheet OZ440-SE100-CAR003_sheet14; Reference: NFM18PC225B0J3; Max Current: 2A; Footprint description: standard 0603 filter package; Pin Count: 3; Rev: 2/11/2011; helpURL: http://www.murata.com/products/emc/application/pdf/EMIAPDCE_2.pdf; Supplier 1: Digi-Key; Supplier Part Number 1: NFM18PC225B0J3D-ND; Supplier 2: Mouser; Supplier Part Number 2: 81-NFM18PC225B0J3D
J11 = 72309-8044BLF: Dual USB Type A connector; Manufacturer: FCI; Validated: False; Reference: 72309-8044BLF; Footprint description: Dual USB type A; Pin Count: 8; Rev: AJ; helpURL: http://portal.fciconnect.com/Comergent//fci/drawing/72309.pdf; Supplier 1: Mouser; Supplier Part Number 1: 649-72309-8044BLF; Supplier 2: Farnell; Supplier Part Number 2: 1835462
L9 L10 = EXC34CE900: USB common mode inductor; Manufacturer: PANASONIC; Max Current: 0.25A; Validated: False; Reference: EXC34CE900; Footprint description: SMD 4 pin; Pin Count: 4; Rev: 11/2012; helpURL: http://www.farnell.com/datasheets/1790924.pdf; Supplier 1: Farnell; Supplier Part Number 1: 1893883; Supplier 2: Mouser; Supplier Part Number 2: 667-EXC-34CE900U
Q24 Q25 = SP3003-02JTG: as Q17 on sheet OZ440-SE100-CAR003_sheet14; Reference: SP3003-02JTG; component type: DIODE; Footprint description: SC70; Pin Count: 5; Rev: 20/08/13; helpURL: http://www.littelfuse.com/~/media/electronics/datasheets/tvs_diode_arrays/littelfuse_tvs_diode_array_sp3003_datasheet.pdf.pdf; Supplier 1: Farnell; Supplier Part Number 1: 2369568; Supplier 2: Mouser; Supplier Part Number 2: 576-SP3003-02JTG
Q26 Q27 = IRMLS6702TRPBF: 2A P channel MOSFET in MICRO6 package; Manufacturer: IRF; Max Voltage: 20V; Rated Power: 1.7W; Validated: False; Reference: IRMLS6702TRPBF; component type: PMOS; Max Current: 2A; Footprint description: MICRO6 SMD package; Pin Count: 6; Rev: 3/18/04; helpURL: http://www.irf.com/product-info/datasheets/data/irlms6702.pdf; Supplier 1: Farnell; Supplier Part Number 1: 1013479; Supplier 2: Digi-Key; Supplier Part Number 2: IRLMS6702PBFCT-ND
Q28 Q29 = 2N7002: as Q23 on sheet OZ440-SE100-CAR003_sheet14; Reference: 2N7002; component type: NMOS; Footprint description: SOT23; Pin Count: 3; Rev: A1; helpURL: http://www.fairchildsemi.com/ds/2N/2N7000.pdf; Supplier 1: Farnell; Supplier Part Number 1: 9845313; Supplier 2: Newark; Supplier Part Number 2: 58K9651
R106-R108 = CRCW080510K0FKxx: as R90 on sheet OZ440-SE100-CAR003_sheet13; Reference: CRCW080510K0FKxx; Footprint description: standard 0805 SMD; Pin Count: 2; helpURL: http://www.vishay.com/docs/20035/dcrcwe3.pdf; Supplier 1: Farnell; Supplier Part Number 1: 1469856; Supplier 2: Mouser; Supplier Part Number 2: 71-CRCW0805-10K-E3
R109 R110 = CRCW0805300RFKxx: as R91 on sheet OZ440-SE100-CAR003_sheet13; Reference: CRCW0805300RFKxx; Footprint description: standard 0805 SMD; Pin Count: 2; helpURL: http://www.vishay.com/docs/20035/dcrcwe3.pdf; Supplier 1: Mouser; Supplier Part Number 1: 71-CRCW0805300RFKEA; Supplier 2: Farnell; Supplier Part Number 2: 1152346
R111 R112 = CRCW0805100KFKxx: as R96 on sheet OZ440-SE100-CAR003_sheet13; Reference: CRCW0805100KFKxx; Footprint description: standard 0805 SMD; Pin Count: 2; helpURL: http://www.vishay.com/docs/20035/dcrcwe3.pdf; Supplier 1: Farnell; Supplier Part Number 1: 1469860; Supplier 2: Mouser; Supplier Part Number 2: 71-CRCW0805-100K-E3

## Sheet OZ440-SE100-CAR003_sheet16.SchDoc
size A3
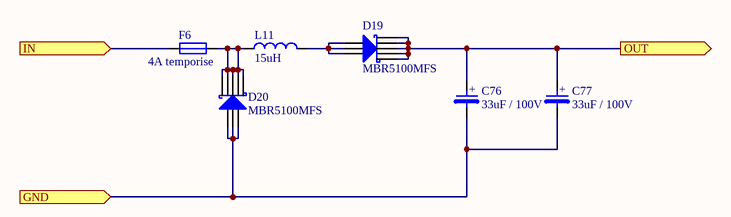
[diagram p15: OZ440-SE100-CAR003_sheet16.SchDoc]

### Parts
C76  Displayed reference: 33uF / 100V  [CAP-ELECTRO-SMD_SIZE_G]  (hidden comment: CAP-POL-SMD)
C77  Displayed reference: 33uF / 100V  [CAP-ELECTRO-SMD_SIZE_G]  (hidden comment: CAP-POL-SMD)
D19  Displayed reference: MBR5100MFS  [SO8-SPE-MBR5100MFS]  (hidden comment: MBR5100MFS-SO8)
D20  Displayed reference: MBR5100MFS  [SO8-SPE-MBR5100MFS]  (hidden comment: MBR5100MFS-SO8)
F6  Displayed reference: 4A temporise  [F1206-STD]  (hidden comment: FUSE-SMD)
L11  Displayed reference: 15uH  [L-SPE-XAL60xx]  (hidden comment: IND-SMD)

### Ports
GND (in), IN (in), OUT (out)

### Nets
Logic_Power.GND: C76.2 C77.2 D20.1(A) D20.2(A) D20.3(A) ; port GND
POWER_IN: C76.1 C77.1 D19.5(K) D19.6(K) D19.7(K) D19.8(K) ; port OUT
NetD19_1: D19.1(A) D19.2(A) D19.3(A) L11.2
NetD20_5: D20.5(K) D20.6(K) D20.7(K) D20.8(K) F6.2 L11.1
NetF6_1: F6.1 ; port IN

### Notes on the sheet
- Titre document:
- NAIO TECHNOLOGIES
- 3 Av didier Daurat
- 31400 TOULOUSE
- Auteur:
- Numéro document:
- Verificateur:
- Format:
- A3
- Date:
- Revision:
- Page:
- /
- (in symbol EEE2AA330P) +

### Library data of the parts
C76 C77 = EEE2AA330P: 33uF / 100V Aluminium capacitor SMD; Manufacturer: Panasonic; Max Current: 0.05; Reference: EEE2AA330P; Value: 33uF; Max Voltage: 100V; Material: Aluminium; Footprint description: 10mmx10mm; Pin Count: 2; helpURL: http://industrial.panasonic.com/www-data/pdf/ABA0000/ABA0000CE2.pdf; Supplier 1: Farnell; Supplier Part Number 1: 1899628; Supplier 2: Mouser; Supplier Part Number 2: 667-EEE-2AA330P
D19 D20 = MBR5100MFS: Power shottky Diode; Manufacturer: ON semi; Max Voltage: 100; Max Current: 5A; Validated: False; Reference: MBR5100MFS; component type: Schottky diode; Footprint description: SO8 Flat lead; Pin Count: 10; Rev: D; helpURL: http://www.onsemi.com/pub_link/Collateral/MBR5100MFS-D.PDF; Supplier 1: Mouser; Supplier Part Number 1: 863-MBR5100MFST1G; Supplier 2: Digi-Key; Supplier Part Number 2: MBR5100MFST3G-ND
F6 = MC12CT 004: 1206 4A 63V temporisé; Manufacturer: MULTICOMP; Validated: False; Reference: MC12CT 004; Max Current: 4A; Pin Count: 2; helpURL: http://www.farnell.com/datasheets/1716418.pdf; Supplier 1: Farnell; Supplier Part Number 1: 1841066
L11 = XAL6060-153ME: 15uH SMD inductor; Manufacturer: COILCRAFT; Max Current: 6A; Frequency band: 11Mhz; Validated: False; Reference: XAL6060-153ME; Value: 15uH; Footprint description: SMD 2 pin; Pin Count: 2; Rev: 11/20/12; helpURL: http://www.coilcraft.com/pdfs/xal60xx.pdf; Supplier 1: Mouser; Supplier Part Number 1: 994-XAL6060-153MEB; Supplier 2: Farnell; Supplier Part Number 2: 2289092

## Sheet OZ440-SE100-CAR003_sheet17.SchDoc
size A3
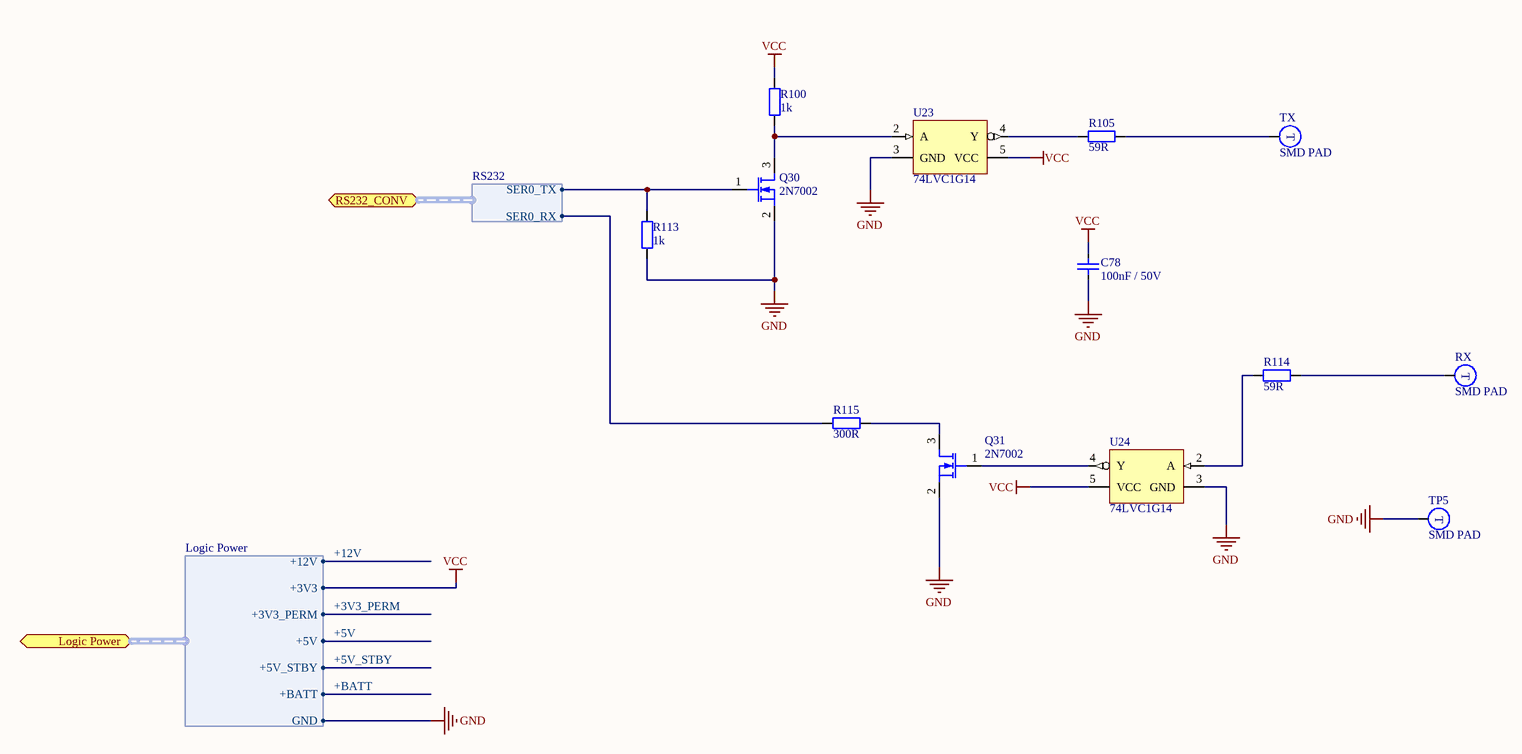
[diagram p16: OZ440-SE100-CAR003_sheet17.SchDoc]

### Parts
C78  Displayed reference: 100nF / 50V  [C0805-STD]  (hidden comment: CAP-SMD)
Q30  Displayed reference: 2N7002  [SOT23-SPE-2N7002]  (hidden comment: 2N7002-SMD3P)
Q31  Displayed reference: 2N7002  [SOT23-SPE-2N7002]  (hidden comment: 2N7002-SMD3P)
R100  Displayed reference: 1k  [R0805-STD]  (hidden comment: RES-SMD)
R105  Displayed reference: 59R  [R0805-STD]  (hidden comment: RES-SMD)
R113  Displayed reference: 1k  [R0805-STD]  (hidden comment: RES-SMD)
R114  Displayed reference: 59R  [R0805-STD]  (hidden comment: RES-SMD)
R115  Displayed reference: 300R  [R0805-STD]  (hidden comment: RES-SMD)
RX  Displayed reference: SMD PAD  [MEC-STD-SMD_PAD_2mm]  (hidden comment: TP-STD-TEST_POINT)  (no BOM)
TP5  Displayed reference: SMD PAD  [MEC-STD-SMD_PAD_2mm]  (hidden comment: TP-STD-TEST_POINT)  (no BOM)
TX  Displayed reference: SMD PAD  [MEC-STD-SMD_PAD_2mm]  (hidden comment: TP-STD-TEST_POINT)  (no BOM)
U23  Displayed reference: 74LVC1G14  [SOT353-1_5pin-STD]  (hidden comment: 74xxx1G14GW-SOT353-1)
U24  Displayed reference: 74LVC1G14  [SOT353-1_5pin-STD]  (hidden comment: 74xxx1G14GW-SOT353-1)

### Ports
Logic Power (harness Logic Power), RS232_CONV (harness RS232)

### Harnesses
RS232: SER0_RX, SER0_TX
Logic Power: +12V, +3V3, +3V3_PERM, +5V, +5V_STBY, +BATT, GND

### Nets
+5V: port Logic Power.+5V, port Logic Power.+5V_STBY  [also labelled +5V_STBY]
GND: C78.1 Q30.2(S) Q31.2(S) R113.1 TP5.1(T) U23.3(GND) U24.3(GND) ; port Logic Power.GND  [project net Logic_Power.GND]
VCC: C78.2 R100.2 U23.5(VCC) U24.5(VCC) ; port Logic Power.+3V3  [project net +3V3]
RS232.SER0_RX: R115.2 ; port RS232_CONV.SER0_RX
RS232.SER0_TX: Q30.1(G) R113.2 ; port RS232_CONV.SER0_TX
NetQ30_3: Q30.3(D) R100.1 U23.2(A)
NetQ31_1: Q31.1(G) U24.4(Y)
NetQ31_3: Q31.3(D) R115.1
NetR105_1: R105.1 U23.4(Y)
NetR105_2: R105.2 TX.1(T)
NetR114_1: R114.1 U24.2(A)
NetR114_2: R114.2 RX.1(T)

### Notes on the sheet
- Titre document:
- NAIO TECHNOLOGIES
- 3 Av didier Daurat
- 31400 TOULOUSE
- Auteur:
- Numéro document:
- Verificateur:
- Format:
- A3
- Date:
- Revision:
- Page:
- /

### Library data of the parts
C78 = VJ0805Y104KXAxx: as C59 on sheet OZ440-SE100-CAR003_sheet13; Reference: VJ0805Y104KXAxx; Value: 100nF; Material: X7R; Footprint description: standard Capacitor 0805; Pin Count: 2; helpURL: http://www.vishay.com/docs/45200/highrels.pdf; Supplier 1: Farnell; Supplier Part Number 1: 1612208; Supplier 2: Digi-Key; Supplier Part Number 2: 720-1266-6-ND
Q30 Q31 = 2N7002: as Q23 on sheet OZ440-SE100-CAR003_sheet14; Reference: 2N7002; component type: NMOS; Footprint description: SOT23; Pin Count: 3; Rev: A1; helpURL: http://www.fairchildsemi.com/ds/2N/2N7000.pdf; Supplier 1: Farnell; Supplier Part Number 1: 9845313; Supplier 2: Newark; Supplier Part Number 2: 58K9651
R100 R113 = CRCW08051K00FKxx: 1k Ohm 0805 SMD resistor; Manufacturer: Vishay; Value: 1 000; Tolerance: 1 %; Rated Power: 0,125 W; Validated: No; Reference: CRCW08051K00FKxx; Footprint description: standard 0805 SMD; Pin Count: 2; helpURL: http://www.vishay.com/docs/20035/dcrcwe3.pdf; Supplier 1: Farnell; Supplier Part Number 1: 1469847; Supplier 2: Mouser; Supplier Part Number 2: 71-CRCW0805-1.0K-E3
R105 R114 = CRCW080559R0FKxx: as R97 on sheet OZ440-SE100-CAR003_sheet13; Reference: CRCW080559R0FKxx; Footprint description: standard 0805 SMD; Pin Count: 2; helpURL: http://www.vishay.com/docs/20035/dcrcwe3.pdf; Supplier 1: Mouser; Supplier Part Number 1: 71-CRCW080559R0FKEA; Supplier 2: Farnell; Supplier Part Number 2: 2138817
R115 = CRCW0805300RFKxx: as R91 on sheet OZ440-SE100-CAR003_sheet13; Reference: CRCW0805300RFKxx; Footprint description: standard 0805 SMD; Pin Count: 2; helpURL: http://www.vishay.com/docs/20035/dcrcwe3.pdf; Supplier 1: Mouser; Supplier Part Number 1: 71-CRCW0805300RFKEA; Supplier 2: Farnell; Supplier Part Number 2: 1152346
RX TP5 TX = SMD Pad: SMD Pad for wire soldering; Validated: False; Reference: SMD Pad; Footprint description: Smd pad; Pin Count: 1
U23 U24 = 74LVC1G14GW: as U22 on sheet OZ440-SE100-CAR003_sheet14; Reference: 74LVC1G14GW; Footprint description: SOT353-1, 5 pin; Pin Count: 5; helpURL: http://www.nxp.com/documents/data_sheet/74LVC1G14.pdf; Supplier 1: Farnell; Supplier Part Number 1: 1631687; Supplier 2: Digi-Key; Supplier Part Number 2: 568-2267-1-ND

## Nets that join several sheets
12V_SENSOR: OZ440-SE100-CAR003_sheet7 (13 pins), OZ440-SE100-CAR003_sheet11 (P9.8)
+3V3: OZ440-SE100-CAR003_Sheet2 (R3.2), OZ440-SE100-CAR003_sheet3 (Q1.1 Q1.2 Q1.3), OZ440-SE100-CAR003_sheet4 (9 pins), OZ440-SE100-CAR003_sheet5 (6 pins), OZ440-SE100-CAR003_sheet9 (5 pins), OZ440-SE100-CAR003_sheet10 (9 pins), OZ440-SE100-CAR003_sheet11 (C80.1 C81.1 R87.1), OZ440-SE100-CAR003_sheet12 (R89.2), OZ440-SE100-CAR003_sheet14 (C75.2 F1.1 R103.2 U22.5), OZ440-SE100-CAR003_sheet15 (R106.2), OZ440-SE100-CAR003_sheet17 (C78.2 R100.2 U23.5 U24.5)
+3V3_PERM: OZ440-SE100-CAR003_sheet3 (7 pins), OZ440-SE100-CAR003_sheet4 (16 pins), OZ440-SE100-CAR003_sheet5 (10 pins), OZ440-SE100-CAR003_sheet7 (R42.1), OZ440-SE100-CAR003_sheet13 (R93.1)
+5V: OZ440-SE100-CAR003_Sheet2 (P2.B84 P2.B85 P2.B86 P2.B87), OZ440-SE100-CAR003_sheet3 (6 pins), OZ440-SE100-CAR003_sheet4 (U4.27), OZ440-SE100-CAR003_sheet7 (R48.2 R53.2 R58.2 R61.2), OZ440-SE100-CAR003_sheet8 (R85.1), OZ440-SE100-CAR003_sheet11 (C80.2 C81.2 U18.3), OZ440-SE100-CAR003_sheet12 (F3.1), OZ440-SE100-CAR003_sheet13 (12 pins), OZ440-SE100-CAR003_sheet15 (F5.1)
Logic_Power.GND: OZ440-SE100-CAR003_Sheet1 (P1.4 TP2.1), OZ440-SE100-CAR003_Sheet2 (28 pins), OZ440-SE100-CAR003_sheet3 (45 pins), OZ440-SE100-CAR003_sheet4 (9 pins), OZ440-SE100-CAR003_sheet5 (24 pins), OZ440-SE100-CAR003_sheet6 (C34.1 C35.1 C36.1 C37.1), OZ440-SE100-CAR003_sheet7 (26 pins), OZ440-SE100-CAR003_sheet8 (18 pins), OZ440-SE100-CAR003_sheet9 (13 pins), OZ440-SE100-CAR003_sheet10 (19 pins), OZ440-SE100-CAR003_sheet11 (13 pins), OZ440-SE100-CAR003_sheet12 (8 pins), OZ440-SE100-CAR003_sheet13 (19 pins), OZ440-SE100-CAR003_sheet14 (24 pins), OZ440-SE100-CAR003_sheet15 (15 pins), OZ440-SE100-CAR003_sheet16 (5 pins), OZ440-SE100-CAR003_sheet17 (7 pins)
5V_EN: OZ440-SE100-CAR003_sheet3 (U2.3), OZ440-SE100-CAR003_sheet4 (R16.2 U4.8)
12V_CAN_EN: OZ440-SE100-CAR003_sheet4 (R18.2 U4.5), OZ440-SE100-CAR003_sheet13 (U20.2)
12V_CAN_PG: OZ440-SE100-CAR003_sheet4 (U4.48), OZ440-SE100-CAR003_sheet13 (R93.2 U20.8)
12V_EN: OZ440-SE100-CAR003_sheet3 (U1.3), OZ440-SE100-CAR003_sheet4 (R15.2 U4.6)
12V_SENSOR_EN: OZ440-SE100-CAR003_sheet4 (R17.2 U4.4), OZ440-SE100-CAR003_sheet7 (U15.2)
24V_POWER: OZ440-SE100-CAR003_Sheet1 (P1.2 TP1.1), OZ440-SE100-CAR003_sheet8 (7 pins)
+12V: OZ440-SE100-CAR003_Sheet2 (12 pins), OZ440-SE100-CAR003_sheet3 (6 pins), OZ440-SE100-CAR003_sheet4 (R20.2), OZ440-SE100-CAR003_sheet7 (U15.3), OZ440-SE100-CAR003_sheet13 (U20.3)
+BATT: OZ440-SE100-CAR003_Sheet2 (P2.A47), OZ440-SE100-CAR003_sheet3 (D3.3), OZ440-SE100-CAR003_sheet4 (Q2.3)
~{ACT}: OZ440-SE100-CAR003_Sheet2 (P2.B2), OZ440-SE100-CAR003_sheet5 (U6.2)
~{BAT_LOW}: OZ440-SE100-CAR003_Sheet2 (P2.A27), OZ440-SE100-CAR003_sheet4 (R21.2 U4.13), OZ440-SE100-CAR003_sheet5 (U10.2)
~{EXCD0_CCPE}: OZ440-SE100-CAR003_Sheet2 (P2.A49), OZ440-SE100-CAR003_sheet10 (R13.1)
~{EXCD0_PERST}: OZ440-SE100-CAR003_Sheet2 (P2.A48), OZ440-SE100-CAR003_sheet10 (J7.22)
~{EXCD1_CCPE}: OZ440-SE100-CAR003_Sheet2 (P2.B48), OZ440-SE100-CAR003_sheet10 (R12.2)
~{MOTOR_FAULT_OD}: OZ440-SE100-CAR003_sheet8 (U16.18), OZ440-SE100-CAR003_sheet13 (R92.1 U19.35)
~{OC_0_1}: OZ440-SE100-CAR003_Sheet2 (P2.B44), OZ440-SE100-CAR003_sheet11 (R87.2)
~{OC_2_3}: OZ440-SE100-CAR003_Sheet2 (P2.A44), OZ440-SE100-CAR003_sheet10 (R81.2)
~{OC_4_5}: OZ440-SE100-CAR003_Sheet2 (P2.B38), OZ440-SE100-CAR003_sheet12 (R89.1)
~{OC_6_7}: OZ440-SE100-CAR003_Sheet2 (P2.A38), OZ440-SE100-CAR003_sheet15 (R106.1)
~{PWR_BUTTON}: OZ440-SE100-CAR003_Sheet2 (P2.B12), OZ440-SE100-CAR003_sheet4 (R22.2 U4.12)
~{SATA_ACT}: OZ440-SE100-CAR003_Sheet2 (P2.A28), OZ440-SE100-CAR003_sheet5 (U5.2)
~{SOFT_OFF}: OZ440-SE100-CAR003_Sheet2 (P2.A24), OZ440-SE100-CAR003_sheet4 (U4.44)
~{SYS_RESET}: OZ440-SE100-CAR003_Sheet2 (P2.B49), OZ440-SE100-CAR003_sheet4 (R26.2 U4.10), OZ440-SE100-CAR003_sheet5 (U9.2), OZ440-SE100-CAR003_sheet8 (R88.1)
~{THRM}: OZ440-SE100-CAR003_Sheet2 (P2.B35), OZ440-SE100-CAR003_sheet4 (R27.2 U4.9), OZ440-SE100-CAR003_sheet5 (U11.2)
~{THRM_TRIP}: OZ440-SE100-CAR003_Sheet2 (P2.A35), OZ440-SE100-CAR003_sheet4 (U4.46)
~{WAKE0}: OZ440-SE100-CAR003_Sheet2 (P2.B66), OZ440-SE100-CAR003_sheet10 (J7.1)
~{WAKE1}: OZ440-SE100-CAR003_Sheet2 (P2.B67), OZ440-SE100-CAR003_sheet4 (R28.1)
CAN_ACT: OZ440-SE100-CAR003_sheet5 (U12.2), OZ440-SE100-CAR003_sheet13 (U19.11 U21.4)
CAN_bus.CANH: OZ440-SE100-CAR003_sheet10 (TP6.1), OZ440-SE100-CAR003_sheet13 (J1.1 P10.7 R97.2 U21.7)
CAN_bus.CANL: OZ440-SE100-CAR003_sheet10 (TP7.1), OZ440-SE100-CAR003_sheet13 (J1.2 P10.8 R99.1 U21.6)
CTREF: OZ440-SE100-CAR003_Sheet2 (P2.A14), OZ440-SE100-CAR003_sheet6 (R41.1)
DPX_AUX_N: OZ440-SE100-CAR003_Sheet2 (P2.B99), OZ440-SE100-CAR003_sheet14 (J10.17 Q22.4)
DPX_AUX_P: OZ440-SE100-CAR003_Sheet2 (P2.B98), OZ440-SE100-CAR003_sheet14 (J10.15 Q22.5)
DPX_AUX_SEL: OZ440-SE100-CAR003_Sheet2 (P2.B95), OZ440-SE100-CAR003_sheet14 (J10.13 R101.2)
DPX_HDP: OZ440-SE100-CAR003_Sheet2 (P2.B89), OZ440-SE100-CAR003_sheet14 (U22.4)
DPX_LANE0_N: OZ440-SE100-CAR003_Sheet2 (P2.B72), OZ440-SE100-CAR003_sheet14 (C68.2)
DPX_LANE0_P: OZ440-SE100-CAR003_Sheet2 (P2.B71), OZ440-SE100-CAR003_sheet14 (C67.2)
DPX_LANE1_N: OZ440-SE100-CAR003_Sheet2 (P2.B74), OZ440-SE100-CAR003_sheet14 (C70.2)
DPX_LANE1_P: OZ440-SE100-CAR003_Sheet2 (P2.B73), OZ440-SE100-CAR003_sheet14 (C69.2)
DPX_LANE2_N: OZ440-SE100-CAR003_Sheet2 (P2.B76), OZ440-SE100-CAR003_sheet14 (C72.2)
DPX_LANE2_P: OZ440-SE100-CAR003_Sheet2 (P2.B75), OZ440-SE100-CAR003_sheet14 (C71.2)
DPX_LANE3_N: OZ440-SE100-CAR003_Sheet2 (P2.B82), OZ440-SE100-CAR003_sheet14 (C74.2)
DPX_LANE3_P: OZ440-SE100-CAR003_Sheet2 (P2.B81), OZ440-SE100-CAR003_sheet14 (C73.2)
LED2_OC: OZ440-SE100-CAR003_sheet4 (R64.1 U4.2), OZ440-SE100-CAR003_sheet5 (U13.2)
LED3_OC: OZ440-SE100-CAR003_sheet4 (R82.1 U4.1), OZ440-SE100-CAR003_sheet5 (U14.2)
MAIN_POWER_LED: OZ440-SE100-CAR003_sheet4 (U4.3), OZ440-SE100-CAR003_sheet5 (U7.2)
MDI0_N: OZ440-SE100-CAR003_Sheet2 (P2.A12), OZ440-SE100-CAR003_sheet6 (J5.10)
MDI0_P: OZ440-SE100-CAR003_Sheet2 (P2.A13), OZ440-SE100-CAR003_sheet6 (J5.11)
MDI1_N: OZ440-SE100-CAR003_Sheet2 (P2.A9), OZ440-SE100-CAR003_sheet6 (J5.5)
MDI1_P: OZ440-SE100-CAR003_Sheet2 (P2.A10), OZ440-SE100-CAR003_sheet6 (J5.4)
MDI2_N: OZ440-SE100-CAR003_Sheet2 (P2.A6), OZ440-SE100-CAR003_sheet6 (J5.2)
MDI2_P: OZ440-SE100-CAR003_Sheet2 (P2.A7), OZ440-SE100-CAR003_sheet6 (J5.3)
MDI3_N: OZ440-SE100-CAR003_Sheet2 (P2.A3), OZ440-SE100-CAR003_sheet6 (J5.9)
MDI3_P: OZ440-SE100-CAR003_Sheet2 (P2.A2), OZ440-SE100-CAR003_sheet6 (J5.8)
MISC_SIG.SPKR: OZ440-SE100-CAR003_Sheet2 (P2.B32), OZ440-SE100-CAR003_sheet4 (R30.2)
NetC51_2: OZ440-SE100-CAR003_sheet8 (C51.2 R75.1 R76.2), OZ440-SE100-CAR003_sheet13 (U19.19)
NetC52_2: OZ440-SE100-CAR003_sheet8 (C52.2 R77.1 R79.2), OZ440-SE100-CAR003_sheet13 (U19.15)
NetC53_2: OZ440-SE100-CAR003_sheet8 (C53.2 R78.1 R80.2), OZ440-SE100-CAR003_sheet13 (U19.14)
NetF6_1: OZ440-SE100-CAR003_Sheet1 (P1.1), OZ440-SE100-CAR003_sheet16 (F6.1)
NetQ1_4: OZ440-SE100-CAR003_sheet3 (Q1.4), OZ440-SE100-CAR003_sheet4 (U4.14)
NetQ28_1: OZ440-SE100-CAR003_sheet13 (U19.2), OZ440-SE100-CAR003_sheet15 (Q28.1 R111.2)
NetQ29_1: OZ440-SE100-CAR003_sheet13 (U19.3), OZ440-SE100-CAR003_sheet15 (Q29.1 R112.2)
NetR42_2: OZ440-SE100-CAR003_sheet4 (U4.47), OZ440-SE100-CAR003_sheet7 (R42.2 U15.8)
NetR83_1: OZ440-SE100-CAR003_sheet8 (R83.1), OZ440-SE100-CAR003_sheet13 (U19.36)
NetR84_1: OZ440-SE100-CAR003_sheet8 (R84.1), OZ440-SE100-CAR003_sheet13 (U19.44)
OUT1_CMD: OZ440-SE100-CAR003_sheet7 (Q6.1), OZ440-SE100-CAR003_sheet13 (U19.38)
OUT2_CMD: OZ440-SE100-CAR003_sheet7 (Q7.1), OZ440-SE100-CAR003_sheet13 (U19.39)
OUT3_CMD: OZ440-SE100-CAR003_sheet7 (Q10.1), OZ440-SE100-CAR003_sheet13 (U19.40)
OUT4_CMD: OZ440-SE100-CAR003_sheet7 (Q11.1), OZ440-SE100-CAR003_sheet13 (U19.41)
PCIE_CLK_REF_N: OZ440-SE100-CAR003_Sheet2 (P2.A89), OZ440-SE100-CAR003_sheet10 (J7.11)
PCIE_CLK_REF_P: OZ440-SE100-CAR003_Sheet2 (P2.A88), OZ440-SE100-CAR003_sheet10 (J7.13)
PCIE_RX0_N: OZ440-SE100-CAR003_Sheet2 (P2.B69), OZ440-SE100-CAR003_sheet10 (J7.23)
PCIE_RX0_P: OZ440-SE100-CAR003_Sheet2 (P2.B68), OZ440-SE100-CAR003_sheet10 (J7.25)
PCIE_TX0_N: OZ440-SE100-CAR003_Sheet2 (P2.A69), OZ440-SE100-CAR003_sheet10 (J7.31)
PCIE_TX0_P: OZ440-SE100-CAR003_Sheet2 (P2.A68), OZ440-SE100-CAR003_sheet10 (J7.33)
PCIe_USB_N: OZ440-SE100-CAR003_Sheet2 (P2.A42), OZ440-SE100-CAR003_sheet10 (J7.36)
PCIe_USB_P: OZ440-SE100-CAR003_Sheet2 (P2.A43), OZ440-SE100-CAR003_sheet10 (J7.38)
POWER_IN: OZ440-SE100-CAR003_sheet3 (12 pins), OZ440-SE100-CAR003_sheet4 (R19.2), OZ440-SE100-CAR003_sheet16 (6 pins)
PWR_OK: OZ440-SE100-CAR003_Sheet2 (P2.B24), OZ440-SE100-CAR003_sheet4 (R23.2 U4.11), OZ440-SE100-CAR003_sheet5 (U8.2)
RS232.SER0_RX: OZ440-SE100-CAR003_Sheet2 (P2.A99), OZ440-SE100-CAR003_sheet17 (R115.2)
RS232.SER0_TX: OZ440-SE100-CAR003_Sheet2 (P2.A98), OZ440-SE100-CAR003_sheet17 (Q30.1 R113.2)
SATA0_RX_N: OZ440-SE100-CAR003_Sheet2 (P2.A20), OZ440-SE100-CAR003_sheet9 (J6.25)
SATA0_RX_P: OZ440-SE100-CAR003_Sheet2 (P2.A19), OZ440-SE100-CAR003_sheet9 (J6.23)
SATA0_TX_N: OZ440-SE100-CAR003_Sheet2 (P2.A17), OZ440-SE100-CAR003_sheet9 (J6.31)
SATA0_TX_P: OZ440-SE100-CAR003_Sheet2 (P2.A16), OZ440-SE100-CAR003_sheet9 (J6.33)
SENSOR1_IN: OZ440-SE100-CAR003_sheet7 (C40.2 D11.K R49.1 R50.2), OZ440-SE100-CAR003_sheet13 (U19.20)
SENSOR2_IN: OZ440-SE100-CAR003_sheet7 (C41.2 D12.K R54.1 R57.2), OZ440-SE100-CAR003_sheet13 (U19.21)
SENSOR3_IN: OZ440-SE100-CAR003_sheet7 (C42.2 D13.K R59.1 R60.2), OZ440-SE100-CAR003_sheet13 (U19.22)
SENSOR4_IN: OZ440-SE100-CAR003_sheet7 (C43.2 D14.K R62.1 R63.2), OZ440-SE100-CAR003_sheet13 (U19.24)
SLEEP: OZ440-SE100-CAR003_Sheet2 (P2.B103), OZ440-SE100-CAR003_sheet4 (R29.1)
SMB_CK: OZ440-SE100-CAR003_Sheet2 (P2.B13), OZ440-SE100-CAR003_sheet9 (J6.30), OZ440-SE100-CAR003_sheet10 (J7.30)
SMB_DAT: OZ440-SE100-CAR003_Sheet2 (P2.B14), OZ440-SE100-CAR003_sheet9 (J6.32), OZ440-SE100-CAR003_sheet10 (J7.32)
USB0_N: OZ440-SE100-CAR003_Sheet2 (P2.A45), OZ440-SE100-CAR003_sheet11 (L4.1)
USB0_P: OZ440-SE100-CAR003_Sheet2 (P2.A46), OZ440-SE100-CAR003_sheet11 (L4.4)
USB1_N: OZ440-SE100-CAR003_Sheet2 (P2.B45), OZ440-SE100-CAR003_sheet11 (L5.1)
USB1_P: OZ440-SE100-CAR003_Sheet2 (P2.B46), OZ440-SE100-CAR003_sheet11 (L5.4)
USB3_N: OZ440-SE100-CAR003_Sheet2 (P2.B42), OZ440-SE100-CAR003_sheet11 (L6.1)
USB3_P: OZ440-SE100-CAR003_Sheet2 (P2.B43), OZ440-SE100-CAR003_sheet11 (L6.4)
USB4_N: OZ440-SE100-CAR003_Sheet2 (P2.A39), OZ440-SE100-CAR003_sheet12 (L7.1)
USB4_P: OZ440-SE100-CAR003_Sheet2 (P2.A40), OZ440-SE100-CAR003_sheet12 (L7.4)
USB5_N: OZ440-SE100-CAR003_Sheet2 (P2.B39), OZ440-SE100-CAR003_sheet12 (L8.1)
USB5_P: OZ440-SE100-CAR003_Sheet2 (P2.B40), OZ440-SE100-CAR003_sheet12 (L8.4)
USB6_N: OZ440-SE100-CAR003_Sheet2 (P2.A36), OZ440-SE100-CAR003_sheet15 (L9.2)
USB6_P: OZ440-SE100-CAR003_Sheet2 (P2.A37), OZ440-SE100-CAR003_sheet15 (L9.3)
USB7_N: OZ440-SE100-CAR003_Sheet2 (P2.B36), OZ440-SE100-CAR003_sheet15 (L10.2)
USB7_P: OZ440-SE100-CAR003_Sheet2 (P2.B37), OZ440-SE100-CAR003_sheet15 (L10.3)

## Assembly variants
V2.0: not fitted J4 Q3 R1 R2 R3 R30 R41